# EAGLE design catch_robo (EAGLE 7.2.0)
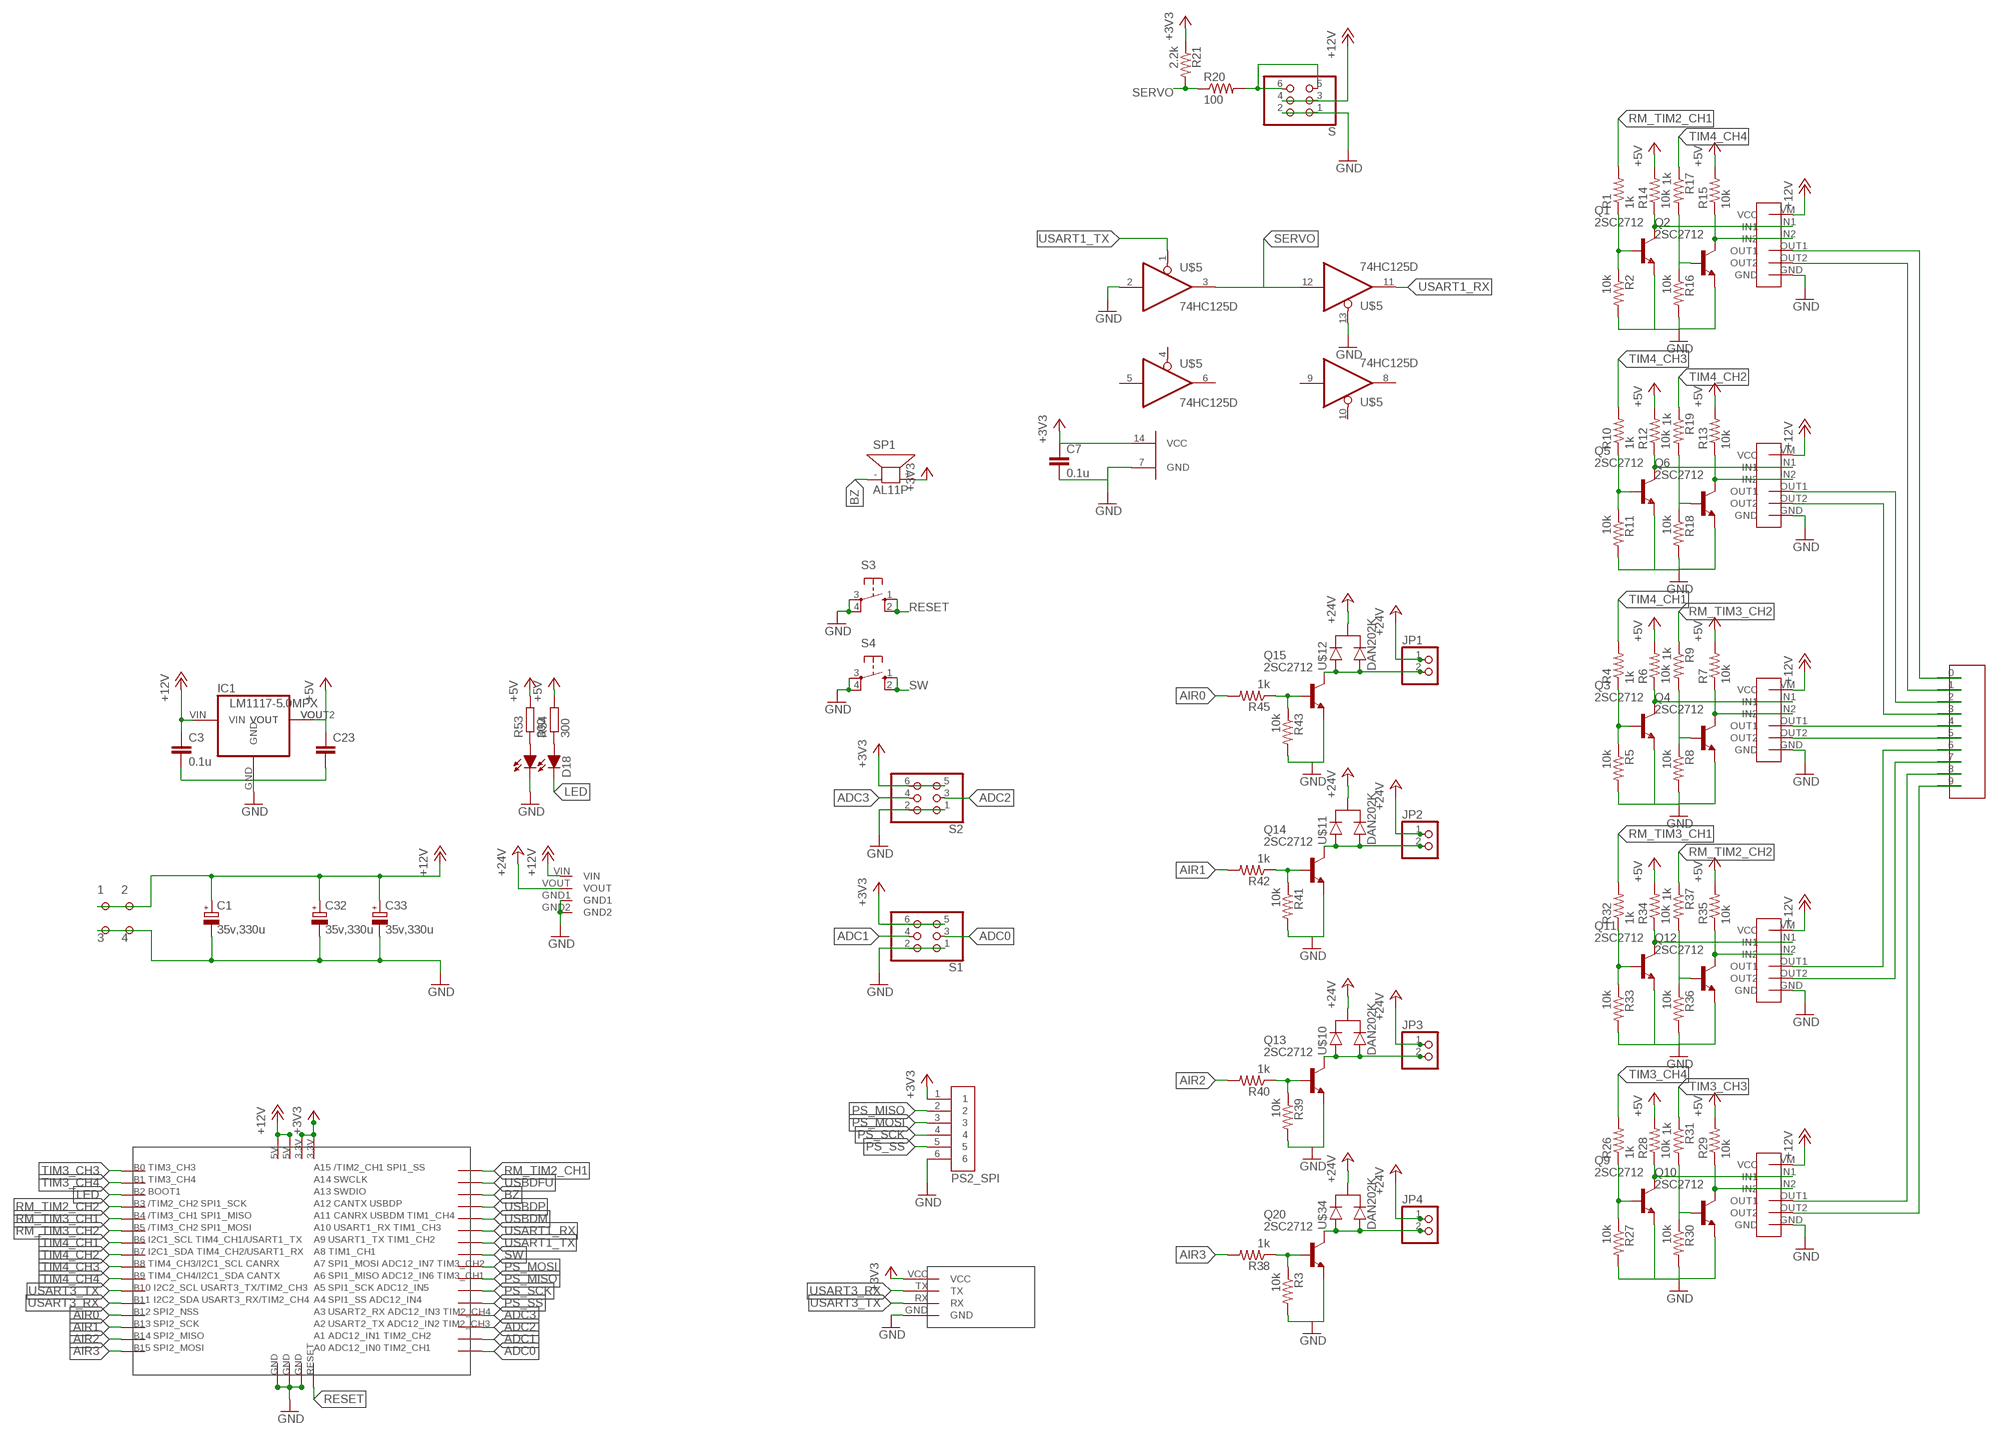
[diagram p0: schematic, sheet 1]

## Parts
C1  35v,330u  CPOL-EU153CLV-1010  [153CLV-1010]
C3  0.1u  C-EUC0603K  [C0603K]
C7  0.1u  C-EUC0603  [C0603]
C23  C-EUC0603K  [C0603K]
C32  35v,330u  CPOL-EU153CLV-1010  [153CLV-1010]
C33  35v,330u  CPOL-EU153CLV-1010  [153CLV-1010]
D18  SEC2XX4  [LED3025]
IC1  LM1117-5.0MPX  LM1117-5.0IMP  [SOT223]
JP1  PINHD-1X2/90  [1X02/90]
JP2  PINHD-1X2/90  [1X02/90]
JP3  PINHD-1X2/90  [1X02/90]
JP4  PINHD-1X2/90  [1X02/90]
PS2_SPI  CN6  [JST-B6B-XH-A]
Q1  2SC2712  [SC-59(TYPE1)]
Q2  2SC2712  [SC-59(TYPE1)]
Q3  2SC2712  [SC-59(TYPE1)]
Q4  2SC2712  [SC-59(TYPE1)]
Q5  2SC2712  [SC-59(TYPE1)]
Q6  2SC2712  [SC-59(TYPE1)]
Q9  2SC2712  [SC-59(TYPE1)]
Q10  2SC2712  [SC-59(TYPE1)]
Q11  2SC2712  [SC-59(TYPE1)]
Q12  2SC2712  [SC-59(TYPE1)]
Q13  2SC2712  [SC-59(TYPE1)]
Q14  2SC2712  [SC-59(TYPE1)]
Q15  2SC2712  [SC-59(TYPE1)]
Q20  2SC2712  [SC-59(TYPE1)]
R1  1k  R-US_R0603  [R0603]
R2  10k  R-US_R0603  [R0603]
R3  10k  R-US_R0603  [R0603]
R4  1k  R-US_R0603  [R0603]
R5  10k  R-US_R0603  [R0603]
R6  10k  R-US_R0603  [R0603]
R7  10k  R-US_R0603  [R0603]
R8  10k  R-US_R0603  [R0603]
R9  1k  R-US_R0603  [R0603]
R10  1k  R-US_R0603  [R0603]
R11  10k  R-US_R0603  [R0603]
R12  10k  R-US_R0603  [R0603]
R13  10k  R-US_R0603  [R0603]
R14  10k  R-US_R0603  [R0603]
R15  10k  R-US_R0603  [R0603]
R16  10k  R-US_R0603  [R0603]
R17  1k  R-US_R0603  [R0603]
R18  10k  R-US_R0603  [R0603]
R19  1k  R-US_R0603  [R0603]
R20  100  R-US_R0603  [R0603]
R21  2.2k  R-US_R0603  [R0603]
R26  1k  R-US_R0603  [R0603]
R27  10k  R-US_R0603  [R0603]
R28  10k  R-US_R0603  [R0603]
R29  10k  R-US_R0603  [R0603]
R30  10k  R-US_R0603  [R0603]
R31  1k  R-US_R0603  [R0603]
R32  1k  R-US_R0603  [R0603]
R33  10k  R-US_R0603  [R0603]
R34  10k  R-US_R0603  [R0603]
R35  10k  R-US_R0603  [R0603]
R36  10k  R-US_R0603  [R0603]
R37  1k  R-US_R0603  [R0603]
R38  1k  R-US_R0603  [R0603]
R39  10k  R-US_R0603  [R0603]
R40  1k  R-US_R0603  [R0603]
R41  10k  R-US_R0603  [R0603]
R42  1k  R-US_R0603  [R0603]
R43  10k  R-US_R0603  [R0603]
R45  1k  R-US_R0603  [R0603]
R53  300  R-EU_R0603  [R0603]
R54  300  R-EU_R0603  [R0603]
S  PINHD-2X3/90  [2X03/90]
S1  PINHD-2X3/90  [2X03/90]
S2  PINHD-2X3/90  [2X03/90]
S3  10-XX  [B3F-10XX]
S4  10-XX  [B3F-10XX]
SP1  AL11P  [AL11P]
U$1  STBE_MINI  [STBEE_MINI]
U$2  TB6643  [TB6643]
U$3  TB6643  [TB6643]
U$4  TB6643  [TB6643]
U$5  74HC125D  [SO14]
U$6  TB6643  [TB6643]
U$7  TB6643  [TB6643]
U$8  ML-40  [ML-40]
U$9  LT3580  [LT3580]
U$10  DAN202K  [SC-59]
U$11  DAN202K  [SC-59]
U$12  DAN202K  [SC-59]
U$13  5569  [5569]
U$14  XBEE_2.54  [XBEE_2.54]
U$34  DAN202K  [SC-59]

## Nets
+3V3: C7.1 PS2_SPI.1 R21.1 S1.5 S1.6 S2.5 S2.6 SP1.+ U$1.3.3V1 U$1.3.3V2 U$5.14(VCC) U$14.VCC
+5V [VCC]: C23.1 IC1.VOUT IC1.VOUT2(VOUT) R6.2 R7.2 R12.2 R13.2 R14.2 R15.2 R28.2 R29.2 R34.2 R35.2 R53.2 R54.2
+12V: C1.+ C3.1 C32.+ C33.+ IC1.VIN S.3 S.4 U$1.5V1 U$1.5V2 U$2.VM(VCC) U$3.VM(VCC) U$4.VM(VCC) U$6.VM(VCC) U$7.VM(VCC) U$9.VIN U$13.1 U$13.2
+24V: JP1.1 JP2.1 JP3.1 JP4.1 U$9.VOUT U$10.K U$11.K U$12.K U$34.K
ADC0: S1.3 U$1.A0
ADC1: S1.4 U$1.A1
ADC2: S2.3 U$1.A2
ADC3: S2.4 U$1.A3
AIR0: R45.2 U$1.B12
AIR1: R42.2 U$1.B13
AIR2: R40.2 U$1.B14
AIR3: R38.2 U$1.B15
BZ: SP1.- U$1.A13
GND [GND]: C1.- C3.2 C7.2 C23.2 C32.- C33.- D18.2(C1) IC1.GND PS2_SPI.6 Q1.E Q2.E Q3.E Q4.E Q5.E Q6.E Q9.E Q10.E Q11.E Q12.E Q13.E Q14.E Q15.E Q20.E R2.2 R3.2 R5.2 R8.2 R11.2 R16.2 R18.2 R27.2 R30.2 R33.2 R36.2 R39.2 R41.2 R43.2 S1.1 S1.2 S2.1 S2.2 S3.3(P) S3.4(P1) S4.3(P) S4.4(P1) S.1 S.2 U$1.GND1 U$1.GND2 U$1.GND3 U$2.GND U$3.GND U$4.GND U$5.2(1A) U$5.7(GND) U$5.13(4OE) U$6.GND U$7.GND U$9.GND1 U$9.GND2 U$13.3 U$13.4 U$14.GND
LED: D18.1(C0) U$1.B2
N$1: Q1.B R1.1 R2.1
N$2: Q1.C R14.1 U$2.IN1
N$3: Q2.C R15.1 U$2.IN2
N$4: Q2.B R16.1 R17.2
N$5: U$3.OUT1 U$8.4
N$6: Q13.B R39.1 R40.1
N$7: U$3.OUT2 U$8.5
N$8: Q3.B R4.1 R5.1
N$9: Q3.C R6.1 U$3.IN1
N$10: Q4.C R7.1 U$3.IN2
N$11: Q4.B R8.1 R9.2
N$12: U$4.OUT2 U$8.3
N$13: U$4.OUT1 U$8.2
N$14: Q5.B R10.1 R11.1
N$15: Q5.C R12.1 U$4.IN1
N$16: Q6.C R13.1 U$4.IN2
N$17: Q6.B R18.1 R19.2
N$18: Q9.B R26.1 R27.1
N$19: Q9.C R28.1 U$6.IN1
N$20: Q10.C R29.1 U$6.IN2
N$21: Q10.B R30.1 R31.2
N$22: Q11.B R32.1 R33.1
N$23: Q11.C R34.1 U$7.IN1
N$24: Q12.C R35.1 U$7.IN2
N$25: Q12.B R36.1 R37.2
N$26: U$2.OUT2 U$8.1
N$27: U$2.OUT1 U$8.0
N$29: U$7.OUT1 U$8.6
N$30: U$7.OUT2 U$8.7
N$31: U$6.OUT1 U$8.8
N$32: U$6.OUT2 U$8.9
N$33: R20.2 S.5 S.6
N$37: D18.3(A1) R53.1
N$38: JP2.2 Q14.C U$11.A@1(A1) U$11.A@2(A2)
N$39: JP4.2 Q20.C U$34.A@1(A1) U$34.A@2(A2)
N$40: JP3.2 Q13.C U$10.A@1(A1) U$10.A@2(A2)
N$41: Q14.B R41.1 R42.1
N$43: Q15.B R43.1 R45.1
N$44: JP1.2 Q15.C U$12.A@1(A1) U$12.A@2(A2)
N$58: D18.4(A0) R54.1
N$109: Q20.B R3.1 R38.1
PS_MISO: PS2_SPI.2 U$1.A6
PS_MOSI: PS2_SPI.3 U$1.A7
PS_SCK: PS2_SPI.4 U$1.A5
PS_SS: PS2_SPI.5 U$1.A4
RESET: S3.1(S) S3.2(S1) U$1.RESET
RM_TIM2_CH1: R1.2 U$1.A15
RM_TIM2_CH2: R37.1 U$1.B3
RM_TIM3_CH1: R32.2 U$1.B4
RM_TIM3_CH2: R9.1 U$1.B5
SERVO: R20.1 R21.2 U$5.3(1Y) U$5.12(4A)
SW: S4.1(S) S4.2(S1) U$1.A8
TIM3_CH3: R31.1 U$1.B0
TIM3_CH4: R26.2 U$1.B1
TIM4_CH1: R4.2 U$1.B6
TIM4_CH2: R19.1 U$1.B7
TIM4_CH3: R10.2 U$1.B8
TIM4_CH4: R17.1 U$1.B9
USART1_RX: U$1.A10 U$5.11(4Y)
USART1_TX: U$1.A9 U$5.1(1OE)
USART3_RX: U$1.B11 U$14.TX
USART3_TX: U$1.B10 U$14.RX
USBDFU: U$1.A14
USBDM: U$1.A11
USBDP: U$1.A12
Unconnected: U$5.4(2OE) U$5.5(2A) U$5.6(2Y) U$5.8(3Y) U$5.9(3A) U$5.10(3OE)

## Library data of the parts
C1 C32 C33 = rcl:CPOL-EU: POLARIZED CAPACITOR, European symbol
C3 C23 = resistor:C-EU: CAPACITOR, European symbol
C7 = rcl:C-EU: CAPACITOR, European symbol
D18 = SRT162-010:SEC2XX4
IC1 = Regulator:LM1117: 800mA and 1A Low Dropout (LDO) Positive Regulator 1.8V, 2.5V, 2.85V, 3.3V, 5V, and Adj
JP1-JP4 = pinhead:PINHD-1X2: PIN HEADER
PS2_SPI = con-jst_xh:CN6
Q1-Q6 Q9-Q15 Q20 = Transistor:2SC2712
R1-R21 R26-R43 R45 = rcl:R-US_: RESISTOR, American symbol
R53 R54 = resistor:R-EU_: RESISTOR, European symbol
S S1 S2 = pinhead:PINHD-2X3: PIN HEADER
S3 S4 = switch-omron:10-XX: OMRON SWITCH; MPN: B3F-1000; OC_FARNELL: 176432; OC_NEWARK: 36M3542
SP1 = buzzer:AL11P: SPEAKER Source: Buerklin; OC_FARNELL: unknown; OC_NEWARK: unknown
U$1 = stbee_mini:STBE_MINI
U$2-U$4 U$6 U$7 = tb6643:TB6643
U$5 = 74HC125D:74HC125D
U$8 = ML-40:ML-40
U$9 = lt3580:LT3580
U$10-U$12 U$34 = DAN202K:DAN202K
U$13 = 5569:5569
U$14 = xbee_254:XBEE_2.54

## Board
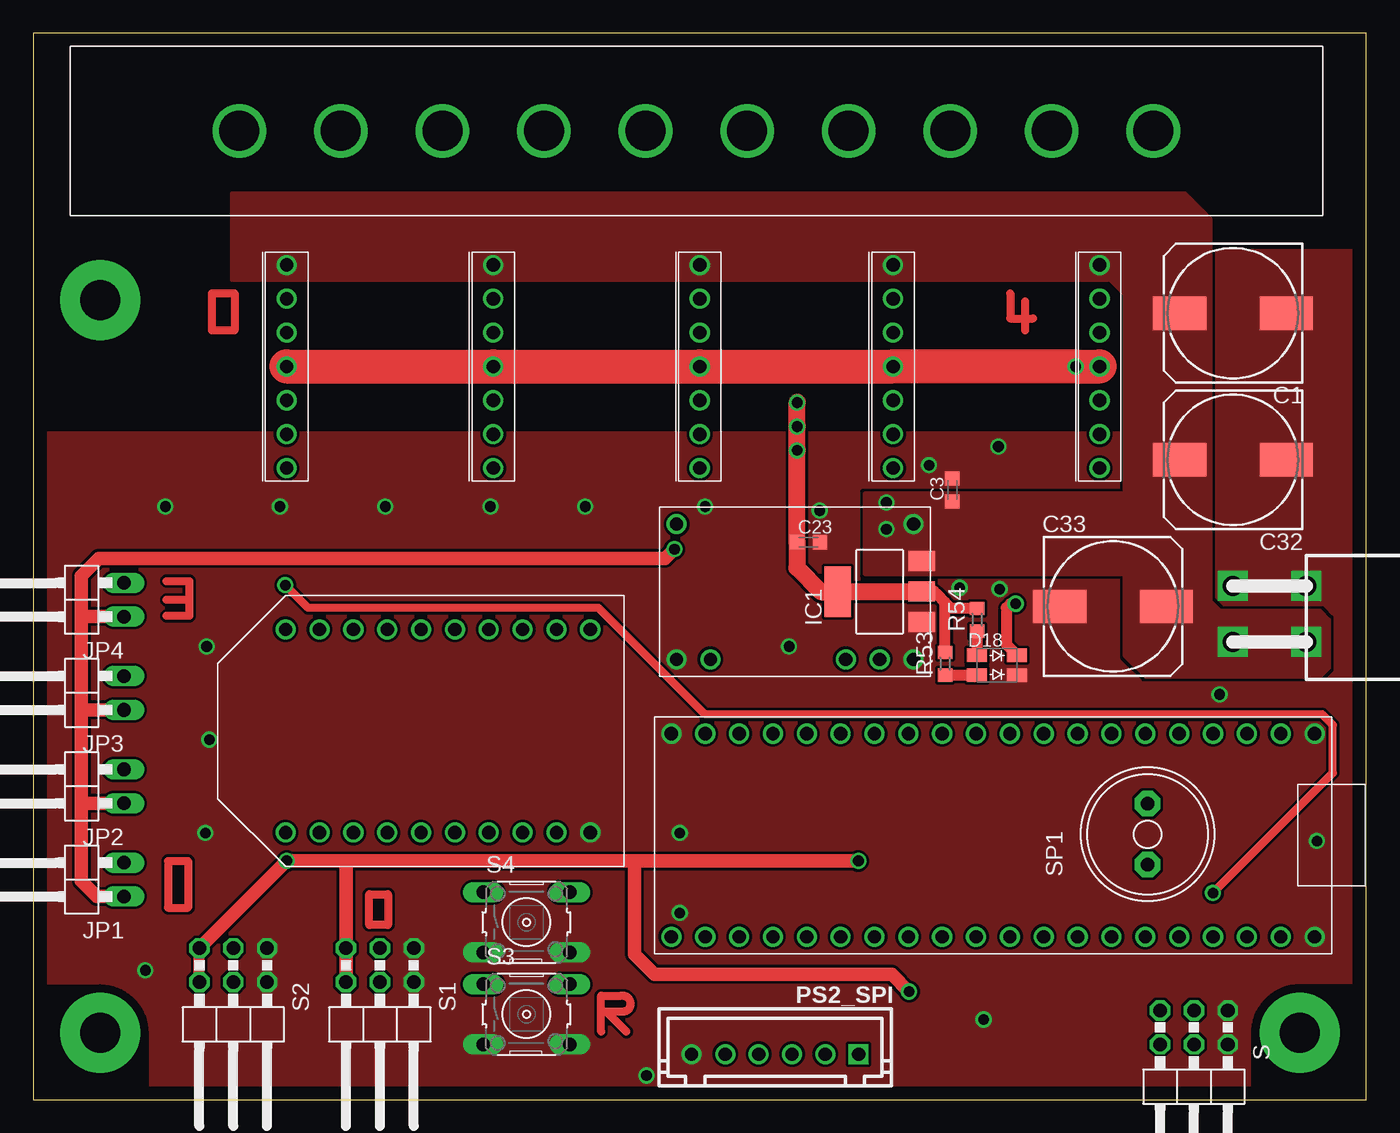
[diagram p1: board, top side]
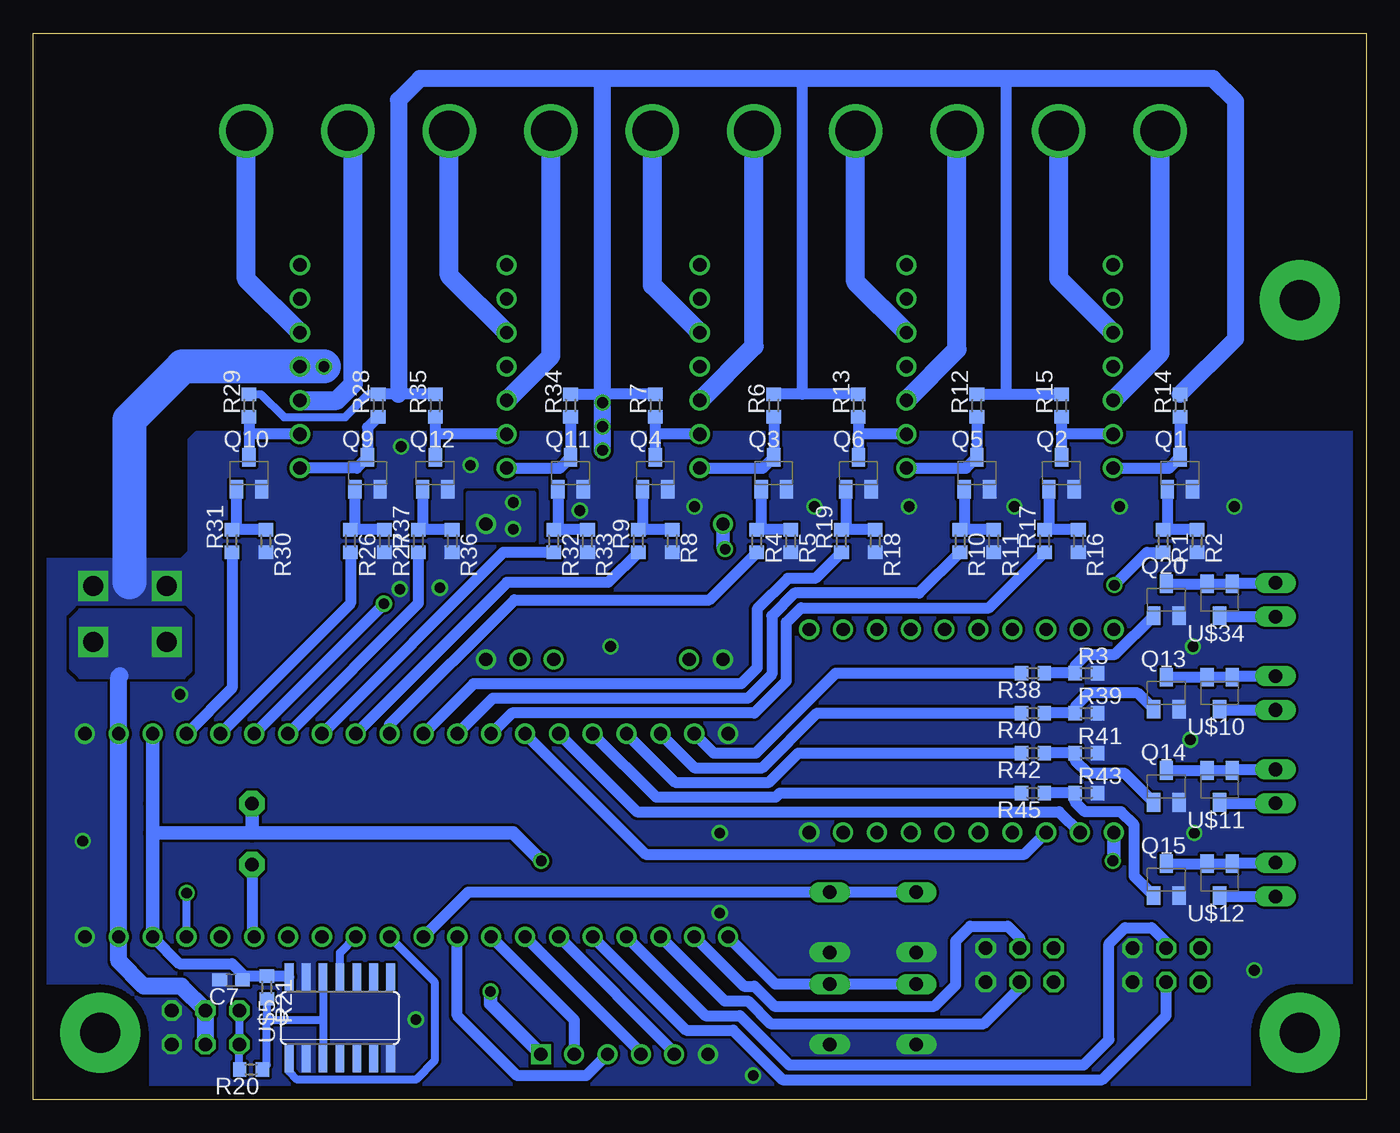
[diagram p2: board, bottom side, seen from below]

Size 100 x 80 mm. Coordinates in mm from the lower left corner, seen from the top.
Outline: 0,0 100,0 100,80 0,80 0,0
Copper layers (1*16): Top 0.035mm / dielectric 1.5mm / Bottom 0.035mm
Design rules "default *": minimum track width 12mil, minimum drill 24mil, track to track 8mil, track to pad 8mil, pad to pad 8mil, via to via 8mil, smd to smd 8mil, copper to edge 40mil, drill to drill 8mil, minimum pad ring 10mil, minimum via ring 8mil, stop-mask expansion 4mil, vias tented up to drill 0mil, thermal gap 10mil
tRestrict: 6 lines
bRestrict: 6 lines

### Footprints (pad centres in the part's own frame; a part is rotated, then mirrored left to right if it is on the bottom)
153CLV-1010 = smd 4 x 2.5: + 4,0; - -4,0
C0603K = smd 1.05 x 1.08: 1 -0.875,0; 2 0.875,0
C0603 = smd 1.1 x 1: 1 -0.85,0; 2 0.85,0
LED3025 = smd 1.5 x 1: 1 1.5,0.75; 2 1.5,-0.75; 3 -1.5,-0.75; 4 -1.5,0.75
SOT223 = smd 1.499 x 2.007: GND -2.261,-3.15; VIN 2.311,-3.15; VOUT 0.025,-3.15 | smd 3.81 x 2.007: VOUT2 0,3.15
1X02/90 = drill 1.016 long: 1 -1.27,-3.81; 2 1.27,-3.81
JST-B6B-XH-A = drill 1 square: 1 0.08,0 | drill 1: 2 2.58,0; 3 5.08,0; 4 7.58,0; 5 10.08,0; 6 12.62,0
SC-59(TYPE1) = smd 1 x 1.4: B -0.95,-1.2; C 0,1.2; E 0.95,-1.2
R0603 = smd 1 x 1.1: 1 -0.85,0; 2 0.85,0
2X03/90 = drill 1.016 octagon: 1 -2.54,-6.35; 2 -2.54,-3.81; 3 0,-6.35; 4 0,-3.81; 5 2.54,-6.35; 6 2.54,-3.81
B3F-10XX = drill 1.016 long: 1 -3.251,2.261; 2 3.251,2.261; 3 -3.251,-2.261; 4 3.251,-2.261
AL11P = drill 1.016 pad 1.905 octagon: + 2.286,0; - -2.286,0
STBEE_MINI = drill 1: 3.3V1 -7.62,19.05; 3.3V2 7.62,19.05; 5V1 -7.62,21.59; 5V2 7.62,21.59; A0 7.62,-21.59; A1 7.62,-19.05; A2 7.62,-16.51; A3 7.62,-13.97; A4 7.62,-11.43; A5 7.62,-8.89; A6 7.62,-6.35; A7 7.62,-3.81; A8 7.62,-1.27; A9 7.62,1.27; A10 7.62,3.81; A11 7.62,6.35; A12 7.62,8.89; A13 7.62,11.43; A14 7.62,13.97; A15 7.62,16.51; B0 -7.62,16.51; B1 -7.62,13.97; B2 -7.62,11.43; B3 -7.62,8.89; B4 -7.62,6.35; B5 -7.62,3.81; B6 -7.62,1.27; B7 -7.62,-1.27; B8 -7.62,-3.81; B9 -7.62,-6.35; B10 -7.62,-8.89; B11 -7.62,-11.43; B12 -7.62,-13.97; B13 -7.62,-16.51; B14 -7.62,-19.05; B15 -7.62,-21.59; GND1 -7.62,24.13; GND2 -7.62,-24.13; GND3 7.62,24.13; RESET 7.62,-24.13
TB6643 = drill 1: GND 0,0; IN1 -7.62,0; IN2 -5.08,0; NC 5.08,0; OUT1 -2.54,0; OUT2 2.54,0; VM 7.62,0
SO14 = smd 2.032 x 0.66: 1 -3.073,3.81; 2 -3.073,2.54; 3 -3.073,1.27; 4 -3.073,0; 5 -3.073,-1.27; 6 -3.073,-2.54; 7 -3.073,-3.81; 8 3.073,-3.81; 9 3.073,-2.54; 10 3.073,-1.27; 11 3.073,0; 12 3.073,1.27; 13 3.073,2.54; 14 3.073,3.81
ML-40 = drill 3 pad 4: 0 0,34.29; 1 0,26.67; 2 0,19.05; 3 0,11.43; 4 0,3.81; 5 0,-3.81; 6 0,-11.43; 7 0,-19.05; 8 0,-26.67; 9 0,-34.29
LT3580 = drill 1: GND1 1.27,11.43; GND2 19.05,11.43; P$2 3.81,11.43; P$4 6.35,11.43; P$5 16.51,11.43; VIN 1.27,1.27; VOUT 19.05,1.27
SC-59 = smd 1 x 1.4: A@1 -0.95,-1.2; A@2 0.95,-1.2; K 0,1.2
5569 = drill 1.5 square: 1 0,2.1; 2 5.5,2.1; 3 0,-2.1; 4 5.5,-2.1
XBEE_2.54 = drill 1: GND 2.54,2.54; P$2 2.54,5.08; P$3 2.54,7.62; P$4 2.54,10.16; P$5 2.54,12.7; P$6 2.54,15.24; P$7 2.54,17.78; P$11 17.78,2.54; P$12 17.78,5.08; P$13 17.78,7.62; P$14 17.78,10.16; P$15 17.78,12.7; P$16 17.78,15.24; P$17 17.78,17.78; P$18 17.78,20.32; P$19 17.78,22.86; P$20 17.78,25.4; RX 2.54,20.32; TX 2.54,22.86; VCC 2.54,25.4

### Placement (x,y rotation side)
C1  90,59 180 top
C3  68.95,45.73 90 top
C7  85.17,8.98 180 bottom
C23  58.16,41.81 0 top
C32  90,48 180 top
C33  81,37 0 top
D18  72.3,32.6 0 top
IC1  63.5,38.1 90 top
JP1  3,16.5 90 top
JP2  3,23.5 90 top
JP3  3,30.5 90 top
JP4  3,37.5 90 top
PS2_SPI  62,3.4 180 top
Q1  13.97,46.99 0 bottom
Q2  22.86,46.99 0 bottom
Q3  44.45,46.99 0 bottom
Q4  53.34,46.99 0 bottom
Q5  29.21,46.99 0 bottom
Q6  38.1,46.99 0 bottom
Q9  74.93,46.99 0 bottom
Q10  83.82,46.99 0 bottom
Q11  59.69,46.99 0 bottom
Q12  69.85,46.99 0 bottom
Q13  15,30.5 0 bottom
Q14  15,23.5 0 bottom
Q15  15,16.5 0 bottom
Q20  15,37.5 0 bottom
R1  15.24,41.91 270 bottom
R2  12.7,41.91 270 bottom
R3  21,32 0 bottom
R4  45.72,41.91 270 bottom
R5  43.18,41.91 270 bottom
R6  44.45,52.07 90 bottom
R7  53.34,52.07 90 bottom
R8  52.07,41.91 270 bottom
R9  54.61,41.91 90 bottom
R10  30.48,41.91 270 bottom
R11  27.94,41.91 270 bottom
R12  29.21,52.07 90 bottom
R13  38.1,52.07 90 bottom
R14  13.97,52.07 90 bottom
R15  22.86,52.07 90 bottom
R16  21.59,41.91 270 bottom
R17  24.13,41.91 90 bottom
R18  36.83,41.91 270 bottom
R19  39.37,41.91 90 bottom
R20  83.67,2.26 180 bottom
R21  82.48,8.41 270 bottom
R26  76.2,41.91 270 bottom
R27  73.66,41.91 270 bottom
R28  74.13,52.07 90 bottom
R29  83.82,52.07 90 bottom
R30  82.55,41.91 270 bottom
R31  85.09,41.91 90 bottom
R32  60.96,41.91 270 bottom
R33  58.42,41.91 270 bottom
R34  59.69,52.07 90 bottom
R35  69.85,52.07 90 bottom
R36  68.58,41.91 270 bottom
R37  71.12,41.91 90 bottom
R38  25,32 180 bottom
R39  21,29 0 bottom
R40  25,29 180 bottom
R41  21,26 0 bottom
R42  25,26 180 bottom
R43  21,23 0 bottom
R45  25,23 180 bottom
R53  68.4,32.7 90 top
R54  70.8,36 90 top
S  87.08,0.33 180 top
S1  26,5 180 top
S2  15,5 180 top
S3  37,6.4 0 top
S4  37,13.3 0 top
SP1  83.6,19.9 90 top
U$1  72,19.83 270 top
U$2  19,55 90 top
U$3  50,55 90 top
U$4  34.5,55 90 top
U$5  77,6.12 90 bottom
U$6  80,55 90 top
U$7  64.5,55 90 top
U$8  49.74,72.68 90 top
U$9  67.31,44.45 180 top
U$10  11,30.5 180 bottom
U$11  11,23.5 180 bottom
U$12  11,16.5 180 bottom
U$13  95.5,36.43 180 top
U$14  44.33,17.49 90 top
U$34  11,37.5 180 bottom

### Tracks (layer width: path | path; a pad name or v marks a point on that pad's centre or on a via)
+3V3  (via drill 0.8)
  Top 0.813: S2.6 S2.5
  Top 1.016: S2.5 v19.01,17.9 23.4,17.9 | 23.4,17.9 45.1,17.9 | 45.1,17.9 v61.9,17.9 | S1.6 S1.5 23.46,17.84 23.4,17.9 | v65.7,8.1 64.4,9.4 46.6,9.4 45.1,10.9 45.1,17.9
  Bottom 0.813: U$1.3.3V2 89.04,10.2 85.1,10.2 84.32,9.42 | 84.32,9.42 C7.1 | U$5.14 80.88,9.26 R21.1 84.16,9.26 84.32,9.42
  Bottom 1.016: U$1.3.3V1 91.05,22.2 | 91.05,22.2 91.05,20 | 91.05,20 U$1.3.3V2 | 91.04,22.19 91.05,22.2 | v61.9,17.9 64,20 83.6,20 | 83.6,20 91.05,20 | SP1.+ 83.6,20 | U$14.VCC 18.93,17.98 v19.01,17.9 | PS2_SPI.1 65.7,7.18 v65.7,8.1
+5V  (via drill 0.8)
  Top 0.813: R53.2 68.4,37.3 | 68.4,37.3 67.85,37.85 67.58,38.12 IC1.VOUT | R54.2 68.85,36.85 68.4,37.3
  Top 1.27: IC1.VOUT 66.62,38.1 IC1.VOUT2 59.1,38.1 57.28,39.91 C23.1 57.3,41.83 v57.3,48.7 v57.3,50.5 v57.3,52.3
  Bottom 0.61: R28.2 74.87,52.92 76.6,51.19 81.2,51.19 82.93,52.92 R29.2
  Bottom 0.813: 27,52.92 27,76.6 | R12.2 27,52.92 | 27,52.92 R15.2 | 42.3,52.92 42.3,76.6 | R13.2 42.3,52.92 | 42.3,52.92 R6.2 | R7.2 57.28,52.92 57.3,52.9 57.32,52.92 R34.2 | R35.2 72.6,52.92 R28.2
  Bottom 1.27: v57.3,48.7 57.3,52.9 57.3,76.6 | R14.2 9.8,57.09 9.8,74.9 11.5,76.6 27,76.6 42.3,76.6 57.3,76.6 | 57.3,76.6 71,76.6 72.6,75 72.6,52.92
+12V  (via drill 0.8)
  Bottom 1.27: 93.5,31.8 93.59,31.71 U$1.5V1 U$1.5V2 93.59,10.39 91.7,8.5 88.9,8.5 S.3 S.4
  other vias: 64,44.8 64,42.8
  pour Top (no thermals): 62.4,45.5 83,45.5 83,41.1 83,39.4 64,39.4 62.4,39.4
  pour Bottom (no thermals): 62.4,45.5 67.4,45.5 67.4,42 62.4,42
  pour Top (no thermals): 14.9,68 86.4,68 88.3,66.1 88.3,37.4 89,36.7 96.5,36.7 97.2,36 97.2,32.4 96.5,31.7 83.5,31.7 81.9,33.3 81.9,60.4 80.8,61.5 14.9,61.5
  pour Bottom (no thermals): 89.2,36.7 96.5,36.7 97.2,36 97.2,32.4 96.5,31.7 88.7,31.7 88.2,32.2 88.2,36.1 88.8,36.7
+24V  (via drill 0.8)
  Top 1.016: v48.1,41.3 47.4,40.6 4.9,40.6 3.6,39.3 3.6,36.2 | 3.6,36.2 3.6,29.3 | 3.6,29.3 3.6,22.3 | 3.6,22.3 3.6,16.4 4.77,15.23 JP1.1 | JP2.1 3.67,22.23 3.6,22.3 | JP4.1 3.63,36.23 3.6,36.2 | JP3.1 3.67,29.23 3.6,29.3
  Bottom 0.813: U$11.K 10.93,22.23 JP2.1 | U$12.K 10.93,15.23 JP1.1 | U$34.K 10.93,36.23 JP4.1 | U$10.K 10.93,29.23 JP3.1
  Bottom 1.016: U$9.VOUT 48.26,41.46 v48.1,41.3
ADC0
  Bottom 0.813: U$1.A0 46.7,8.5 45.9,8.5 44.4,7 32.4,7 30.8,8.6 30.8,11.9 29.7,13 26.9,13 26,12.1 S1.3
ADC1
  Bottom 0.813: U$1.A1 48.14,7.4 46.4,7.4 44.7,5.7 28.7,5.7 26,8.4 S1.4
ADC2
  Bottom 0.813: U$1.A2 49.58,6.3 47,6.3 43.3,2.6 21.2,2.6 19.3,4.5 19.3,11.7 18.1,12.9 16.1,12.9 15,11.8 S2.3
ADC3
  Bottom 0.813: U$1.A3 51.02,5.2 47.5,5.2 43.8,1.5 19.8,1.5 15,6.3 S2.4
AIR0
  Bottom 0.813: U$1.B12 53.28,22.7 44.3,22.7 44,23 R45.2
AIR1
  Bottom 0.813: U$1.B13 51.84,23.8 44.8,23.8 42.6,26 R42.2
AIR2
  Bottom 0.813: U$1.B14 50.4,24.9 45.3,24.9 41.2,29 R40.2
AIR3
  Bottom 0.813: U$1.B15 48.96,26 45.8,26 39.8,32 R38.2
BZ
  Bottom 0.813: SP1.- 83.6,12.38 U$1.A13
GND  (via drill 0.8)
  Top 2.54: U$2.GND U$4.GND U$3.GND U$7.GND v78.2,55 U$6.GND
  Bottom 2.54: v78.2,55 88.8,55 92.8,51 92.8,38.8
  other vias: 50.4,44.5 72.5,38.3 69.5,38.4 67.2,47.6 13,34 13.2,27 12.9,20 8.4,9.7 46,1.8 89,30.4 56.7,34 71.3,6 72.4,49 59,44.2 41.4,44.5 34.3,44.5 26.4,44.5 18.5,44.5 9.9,44.5 96.3,19.4 48.5,20 48.5,14
  pour Top (rank 6, no thermals): -10.16,50 115.57,50 115.57,-10.16 -10.16,-10.16
  pour Top (rank 6, no thermals): 87.7,63.7 102,63.7 102,47.4 87.7,47.4
  pour Bottom (rank 6, no thermals): -19.1,50 87.8,50 88.3,49.5 88.3,41.1 88.9,40.5 107.4,40.5 107.4,-4.5 -19.1,-4.5
LED  (via drill 0.8)
  Top 0.813: v73.7,37.2 73.3,37.2 73,36.9 73,34.15 D18.1
  Bottom 0.813: U$1.B2 73.7,37.18 v73.7,37.2
N$1
  Bottom 0.813: R2.1 14.7,42.76 | 14.7,42.76 R1.1 | Q1.B 14.92,42.98 14.7,42.76
N$2
  Bottom 0.813: R14.1 Q1.C 14.78,47.38 U$2.IN1
N$3
  Bottom 0.813: R15.1 22.86,49.9 | 22.86,49.9 Q2.C | U$2.IN2 22.84,49.92 22.86,49.9
N$4
  Bottom 0.813: R16.1 R17.2 23.81,43.08 Q2.B
N$5
  Bottom 1.422: U$3.OUT1 45.93,56.53 U$8.4
N$6
  Bottom 0.813: Q13.B 17.15,30.5 20.8,30.5 21.85,29.45 R39.1 R40.1
N$7
  Bottom 1.422: U$3.OUT2 53.55,61.09 U$8.5
N$8
  Bottom 0.813: R5.1 R4.1 45.4,43.08 Q3.B
N$9
  Bottom 0.813: R6.1 Q3.C 45.26,47.38 U$3.IN1
N$10
  Bottom 0.813: R7.1 53.34,49.8 | 53.34,49.8 Q4.C | U$3.IN2 53.22,49.92 53.34,49.8
N$11
  Bottom 0.813: R8.1 54.1,42.76 | 54.1,42.76 R9.2 | Q4.B 54.29,42.95 54.1,42.76
N$12
  Bottom 1.422: U$4.OUT2 38.31,61.35 U$8.3
N$13
  Bottom 1.422: U$4.OUT1 30.69,56.27 U$8.2
N$14
  Bottom 0.813: R11.1 R10.1 30.16,43.08 Q5.B
N$15
  Bottom 0.813: R12.1 Q5.C 30.02,47.38 U$4.IN1
N$16
  Bottom 0.813: R13.1 38.1,49.9 | 38.1,49.9 Q6.C | U$4.IN2 38.08,49.92 38.1,49.9
N$17
  Bottom 0.813: R18.1 R19.2 39.05,43.08 Q6.B
N$18
  Bottom 0.813: R27.1 R26.1 75.88,43.08 Q9.B
N$19
  Bottom 0.813: R28.1 74.93,50.42 Q9.C 75.74,47.38 U$6.IN1
N$20
  Bottom 0.813: R29.1 83.82,50 | 83.82,50 Q10.C | U$6.IN2 83.74,49.92 83.82,50
N$21
  Bottom 0.813: R30.1 R31.2 84.77,43.08 Q10.B
N$22
  Bottom 0.813: R33.1 60.4,42.76 | 60.4,42.76 R32.1 | Q11.B 60.64,43 60.4,42.76
N$23
  Bottom 0.813: R34.1 Q11.C 60.5,47.38 U$7.IN1
N$24
  Bottom 0.813: R35.1 69.85,49.7 | 69.85,49.7 Q12.C | U$7.IN2 69.63,49.92 69.85,49.7
N$25
  Bottom 0.813: R36.1 R37.2 70.8,43.08 Q12.B
N$26
  Bottom 1.422: U$2.OUT2 23.07,61.61 U$8.1
N$27
  Bottom 1.422: U$2.OUT1 15.45,56.01 U$8.0
N$28
  Top 0.61: 42.6,5.1 42.6,6.6 | 42.6,6.6 42.6,7.8 44.1,7.8 | 44.8,7.1 arc-90 44.2,6.6 43,6.6 | 43,6.6 42.6,6.6 | 43,6.6 44.5,5.1
N$29
  Bottom 1.422: U$7.OUT1 61.17,55.79 U$8.6
N$30
  Bottom 1.422: U$7.OUT2 68.79,61.83 U$8.7
N$31
  Bottom 1.422: U$6.OUT1 77.24,52.46 76,53.7 76,72.27 U$8.8
N$32
  Bottom 1.422: U$6.OUT2 84.03,61.57 U$8.9
N$33
  Bottom 0.61: S.5 S.6 84.54,2.28 R20.2
N$34  (via drill 3 pad 6)
  other vias: 5,5
N$35  (via drill 3 pad 6)
  other vias: 95,5
N$36  (via drill 3 pad 6)
  other vias: 5,60
N$37
  Top 0.813: R53.1 D18.3
N$38
  Bottom 0.813: Q14.C U$11.A@2 U$11.A@1 9.98,24.77 JP2.2
N$39
  Bottom 0.813: Q20.C U$34.A@2 U$34.A@1 9.98,38.77 JP4.2
N$40
  Bottom 0.813: Q13.C U$10.A@2 U$10.A@1 9.98,31.77 JP3.2
N$41
  Bottom 0.813: Q14.B 18.15,24.5 20.9,24.5 21.85,25.45 R41.1 R42.1
N$42
  Top 0.61: 44.2,7.8 arc-90 44.8,7.2
N$43
  Bottom 0.813: Q15.B 17.4,16.75 17.4,20.6 18.4,21.6 21.1,21.6 21.85,22.35 R43.1 R45.1
N$44
  Bottom 0.813: Q15.C U$12.A@2 U$12.A@1 9.98,17.77 JP1.2
N$45
  Top 0.61: 10.1,17.9 10.1,14.4 11.6,14.4 11.6,17.9 10.1,17.9
N$46
  Top 0.61: 13.4,60.5 15.1,60.5 15.1,57.7 13.4,57.7 13.4,60.5
N$47
  Top 0.61: 73.3,60.5 73.3,58.6 75,58.6
N$48
  Top 0.61: 74.4,59.9 74.4,57.7
N$49
  Top 0.61: 10,38.9 11.7,38.9 11.7,36.3 10.3,36.3
N$50
  Top 0.61: 10.2,36.3 10,36.3
N$51
  Top 0.61: 11.6,37.5 10,37.5
N$52
  Top 0.61: 25.2,15.4 26.6,15.4 26.6,13.1 25.2,13.1 25.2,15.4
N$58
  Top 0.813: R54.1 D18.4
N$109
  Bottom 0.813: R38.1 R3.1 21.85,32.55 21,33.4 18.85,33.4 Q20.B
PS_MISO
  Bottom 0.813: U$1.A6 59.42,5.98 PS2_SPI.2
PS_MOSI
  Bottom 0.813: PS2_SPI.3 58.52,1.8 63.7,1.8 68.19,6.29 U$1.A7
PS_SCK
  Bottom 0.813: PS2_SPI.4 54.42,3.52 U$1.A5
PS_SS
  Bottom 0.813: PS2_SPI.5 51.92,3.56 U$1.A4
RESET
  Bottom 0.813: S3.1 S3.2 44.32,8.66 U$1.RESET
RM_TIM2_CH1  (via drill 0.8)
  Top 0.61: v88.5,15.5 97.5,24.5 97.5,28.1 96.7,28.9 50.4,28.9 42.4,36.9 20.6,36.9 v18.9,38.6
  Bottom 0.61: U$1.A15 v88.51,15.49
  Bottom 0.813: v88.51,15.49 v88.5,15.5 | v18.9,38.6 16.44,41.06 R1.2
RM_TIM2_CH2
  Bottom 0.813: R37.1 71.12,37.22 U$1.B3
RM_TIM3_CH1
  Bottom 0.813: R32.2 64.74,41.06 U$1.B4
RM_TIM3_CH2
  Bottom 0.813: R9.1 56.87,38.8 64.46,38.8 U$1.B5
SERVO
  Bottom 0.61: U$5.12 78.27,6 | 78.27,6 U$5.3 | 78.27,6 82.38,6 82.48,6.1 | R21.2 82.48,6.5 82.48,6.1 | R20.1 82.48,2.6 82.48,6.1
SW
  Bottom 0.813: S4.1 S4.2 67.38,15.56 U$1.A8
TIM3_CH3
  Bottom 0.813: R31.1 85.09,30.87 U$1.B0
TIM3_CH4
  Bottom 0.813: R26.2 76.2,37.22 U$1.B1
TIM4_CH1
  Bottom 0.813: U$1.B6 73.27,28.13 63.9,37.5 49.28,37.5 R4.2
TIM4_CH2
  Bottom 0.813: R19.1 41.33,39.1 43.4,39.1 45.7,36.8 45.7,32.4 46.9,31.2 66.98,31.2 U$1.B7
TIM4_CH3
  Bottom 0.813: R10.2 33.54,38 42.9,38 44.6,36.3 44.6,31.9 46.4,30.1 65.54,30.1 U$1.B8
TIM4_CH4
  Bottom 0.813: R17.1 28.29,36.9 42.4,36.9 43.5,35.8 43.5,31.4 45.9,29 64.1,29 U$1.B9
USART1_RX
  Bottom 0.61: U$5.11 77,11.02 U$1.A10
USART1_TX
  Bottom 0.61: U$1.A9 69.9,8.84 69.9,2.9 71.3,1.5 80.2,1.5 80.81,2.11 U$5.1
USART3_RX
  Bottom 0.813: U$1.B11 54.72,21.6 23.04,21.6 U$14.TX
USART3_TX
  Bottom 0.813: U$1.B10 54.06,18.4 25.64,18.4 U$14.RX